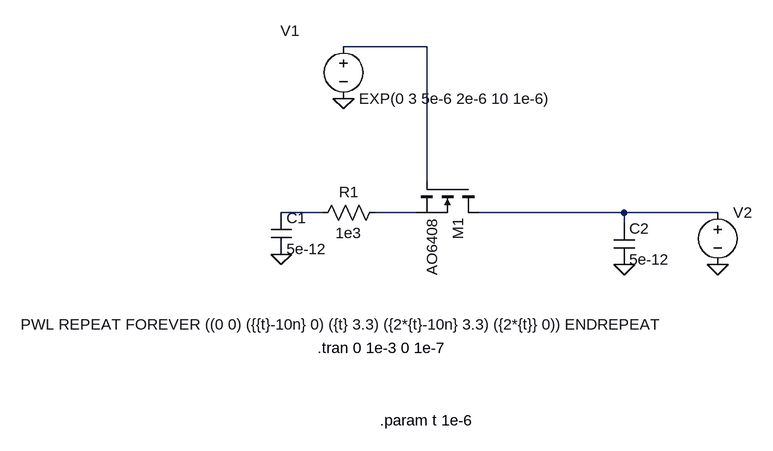
[diagram p0: schematic usb2uart.asc]
usb2uart.asc, the LTspice schematic file:
Version 4
SHEET 1 880 680
WIRE -176 -528 -304 -528
WIRE -176 -320 -176 -528
WIRE -336 -272 -400 -272
WIRE -192 -272 -256 -272
WIRE 128 -272 -96 -272
WIRE 272 -272 128 -272
WIRE 128 -256 128 -272
FLAG -304 -448 0
FLAG -400 -208 0
FLAG 128 -192 0
FLAG 272 -192 0
SYMBOL nmos -96 -320 R90
SYMATTR InstName M1
SYMATTR Value AO6408
SYMBOL cap -416 -272 R0
SYMATTR InstName C1
SYMATTR Value 5e-12
SYMBOL cap 112 -256 R0
SYMATTR InstName C2
SYMATTR Value 5e-12
SYMBOL voltage -304 -544 R0
WINDOW 123 0 0 Left 0
WINDOW 39 0 0 Left 0
WINDOW 0 -97 -8 Left 2
SYMATTR InstName V1
SYMATTR Value EXP(0 3 5e-6 2e-6 10 1e-6)
SYMBOL voltage 272 -288 R0
WINDOW 3 -1073 188 Left 2
SYMATTR Value PWL REPEAT FOREVER ((0 0) ({{t}-10n} 0) ({t} 3.3) ({2*{t}-10n} 3.3) ({2*{t}} 0)) ENDREPEAT
SYMATTR InstName V2
SYMBOL res -240 -288 R90
WINDOW 0 0 56 VBottom 2
WINDOW 3 32 56 VTop 2
SYMATTR InstName R1
SYMATTR Value 1e3
TEXT -344 -64 Left 2 !.tran 0 1e-3 0 1e-7
TEXT -248 48 Left 2 !.param t 1e-6

The netlist it stands for:
* usb2uart.asc
M1 N004 N001 N003 N003 AO6408
C1 N002 0 5e-12
C2 N004 0 5e-12
V1 N001 0 EXP(0 3 5e-6 2e-6 10 1e-6)
V2 N004 0 PWL REPEAT FOREVER ((0 0) ({{t}-10n} 0) ({t} 3.3) ({2*{t}-10n} 3.3) ({2*{t}} 0)) ENDREPEAT
R1 N003 N002 1e3
.model NMOS NMOS
.model PMOS PMOS
.lib standard.mos
.tran 0 1e-3 0 1e-7
.param t 1e-6
.backanno
.end